# EAGLE design module (EAGLE 7.7.0)
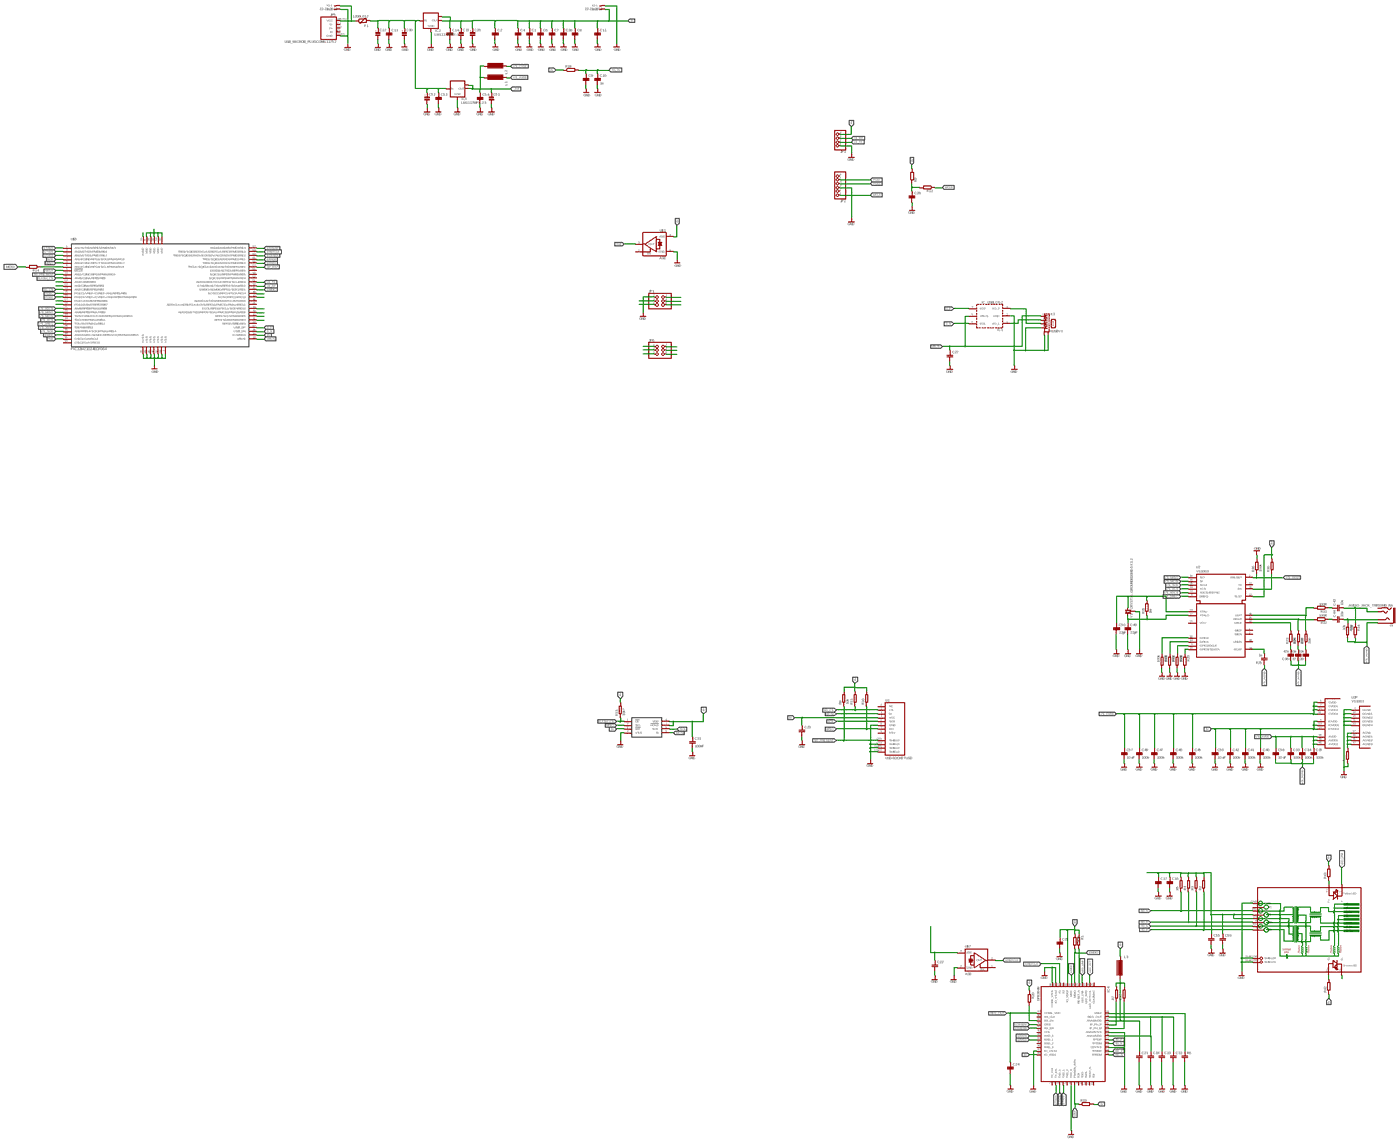
[diagram p0: schematic, sheet 1, overview]
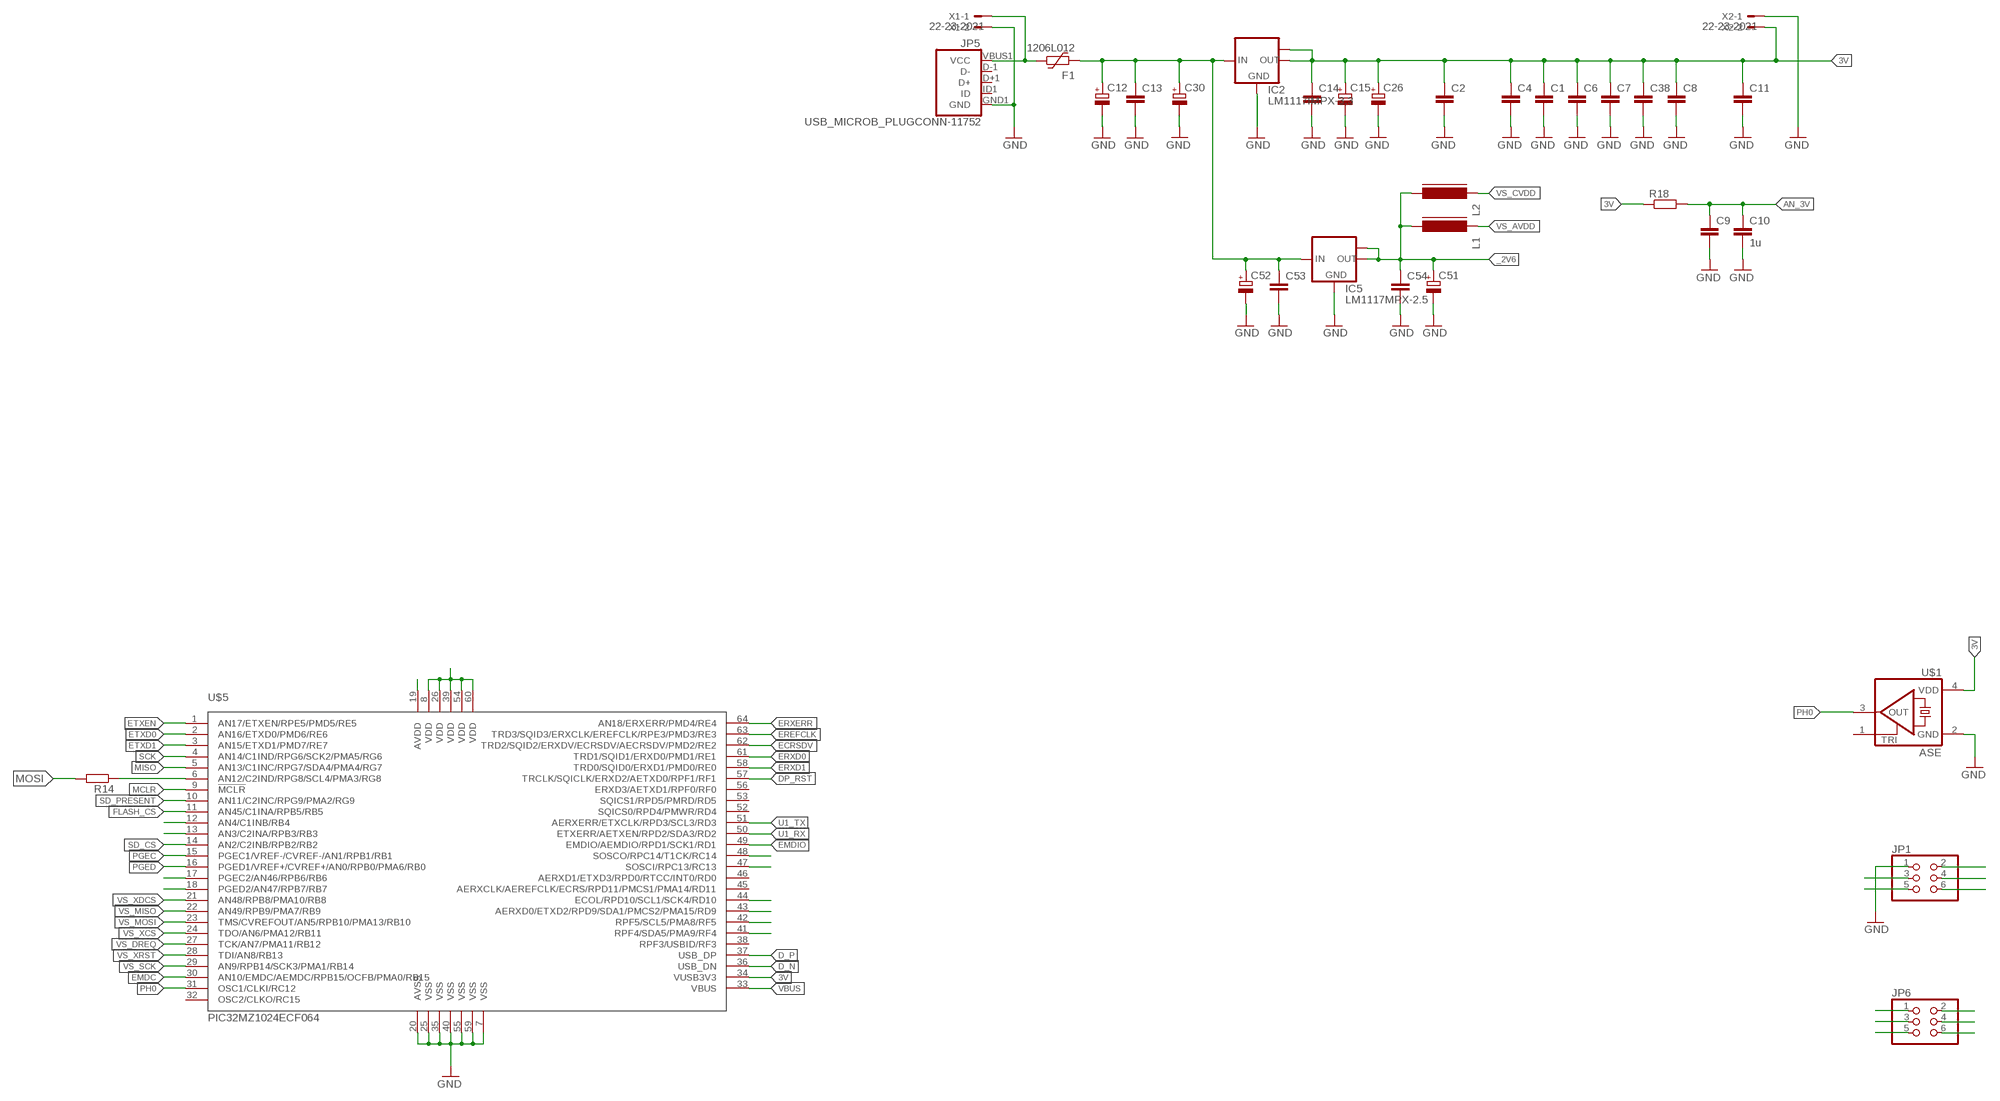
[diagram p1: schematic, sheet 1, part 1 of 4]
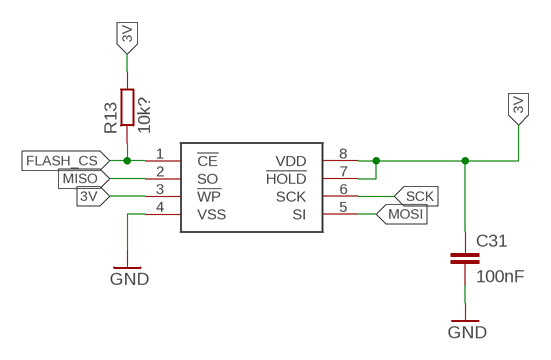
[diagram p2: schematic, sheet 1, part 2 of 4]
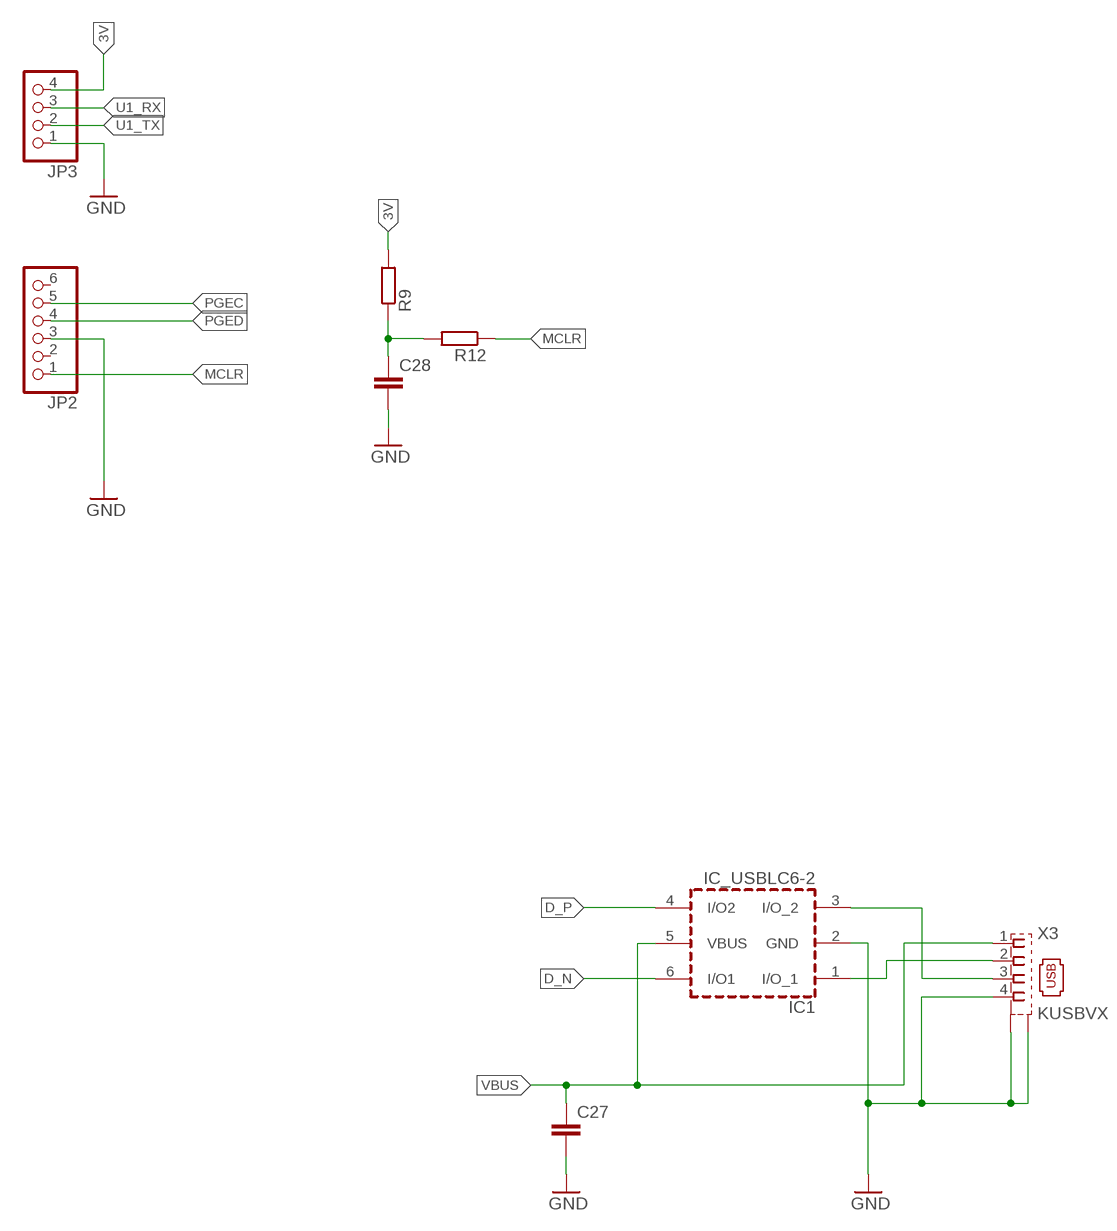
[diagram p3: schematic, sheet 1, part 3 of 4]
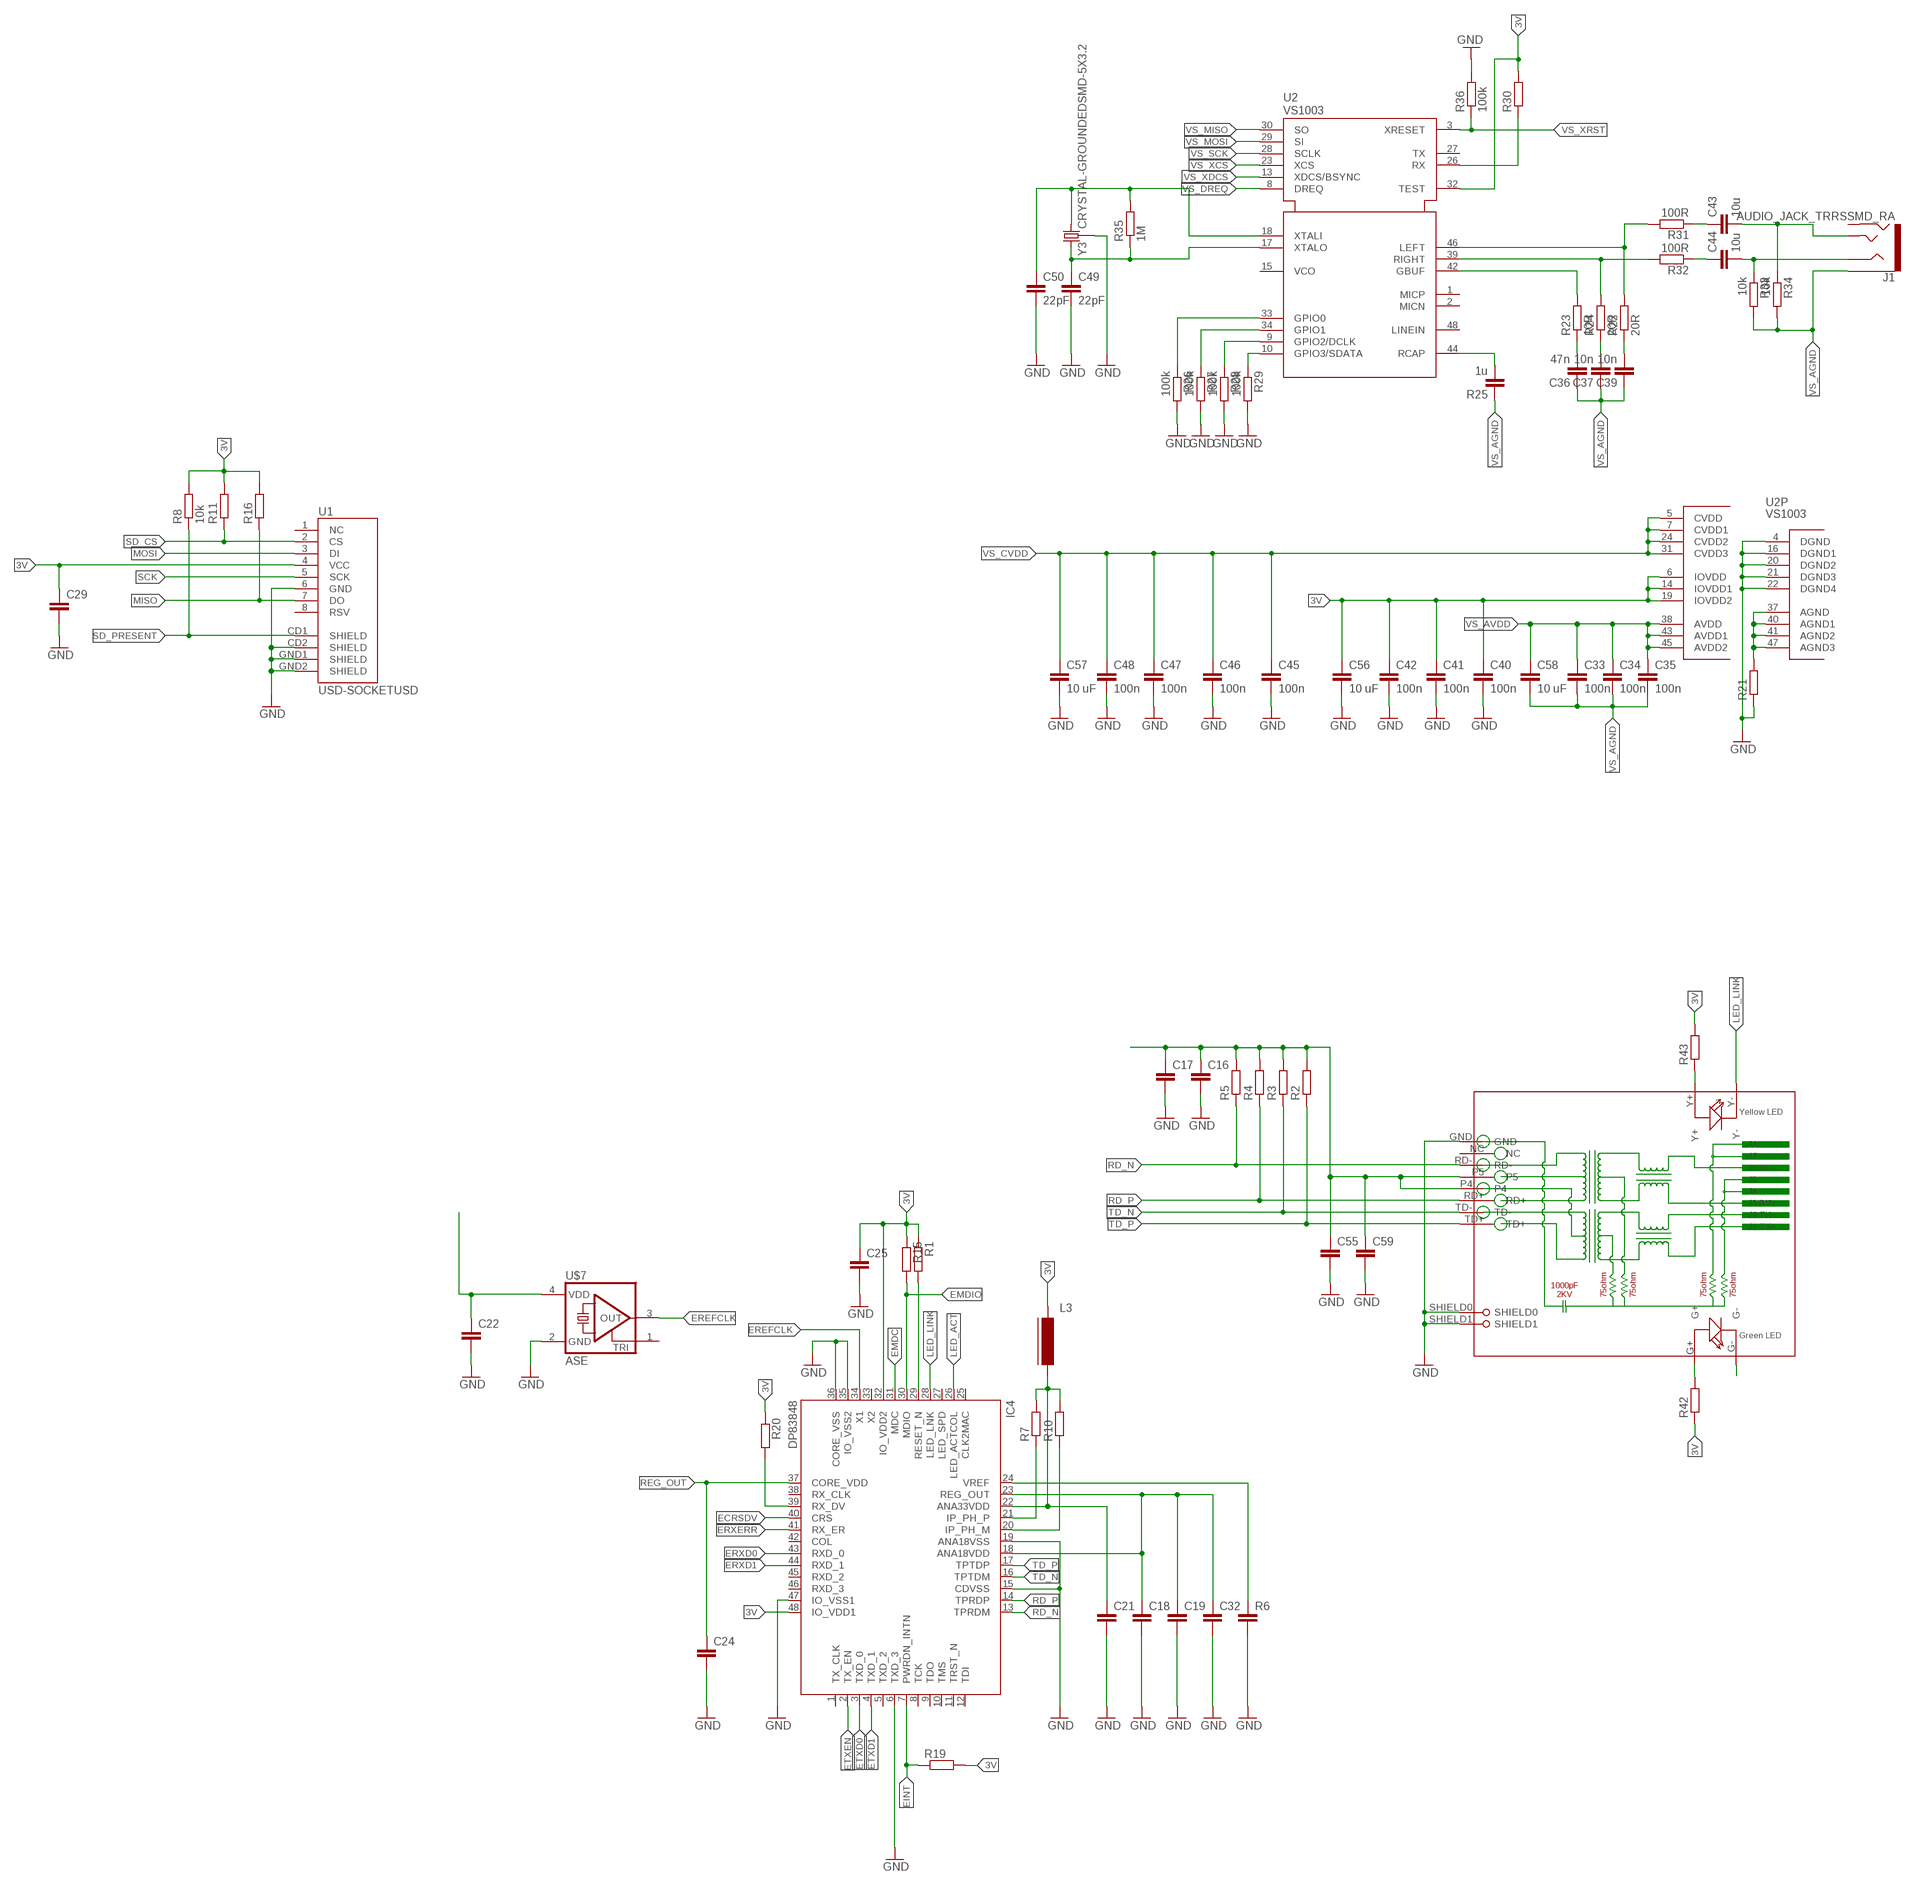
[diagram p4: schematic, sheet 1, part 4 of 4]

## Parts
C1  C-EUC0402  [C0402]
C2  C-EUC0402  [C0402]
C4  C-EUC0402  [C0402]
C6  C-EUC0402  [C0402]
C7  C-EUC0402  [C0402]
C8  C-EUC0402  [C0402]
C9  C-EUC0402  [C0402]
C10  1u  C-EUC0603  [C0603]
C11  C-EUC0402  [C0402]
C12  CPOL-EUSMCB  [SMC_B]
C13  C-EUC0603  [C0603]
C14  C-EUC0603  [C0603]
C15  CPOL-EUSMCB  [SMC_B]
C16  C-EUC0603  [C0603]
C17  C-EUC0603  [C0603]
C18  C-EUC0402  [C0402]
C19  C-EUC0402  [C0402]
C21  C-EUC0402  [C0402]
C22  C-EUC0402  [C0402]
C24  C-EUC0603  [C0603]
C25  C-EUC0603  [C0603]
C26  CPOL-EUSMCA  [SMC_A]
C27  C-EUC0603  [C0603]
C28  C-EUC0603  [C0603]
C29  C-EUC0603  [C0603]
C30  CPOL-EUSMCA  [SMC_A]
C31  100nF  C-EUC0603  [C0603]
C32  C-EUC0603  [C0603]
C33  100n  C-EUC0603  [C0603]
C34  100n  C-EUC0603  [C0603]
C35  100n  C-EUC0603  [C0603]
C36  47n  C-EUC0603  [C0603]
C37  10n  C-EUC0603  [C0603]
C38  C-EUC0402  [C0402]
C39  10n  C-EUC0603  [C0603]
C40  100n  C-EUC0402  [C0402]
C41  100n  C-EUC0402  [C0402]
C42  100n  C-EUC0402  [C0402]
C43  10u  C-EUC0603  [C0603]
C44  10u  C-EUC0603  [C0603]
C45  100n  C-EUC0402  [C0402]
C46  100n  C-EUC0603  [C0603]
C47  100n  C-EUC0603  [C0603]
C48  100n  C-EUC0603  [C0603]
C49  22pF  C-EUC0603  [C0603]
C50  22pF  C-EUC0603  [C0603]
C51  CPOL-EUSMCB  [SMC_B]
C52  CPOL-EUSMCB  [SMC_B]
C53  C-EUC0603  [C0603]
C54  C-EUC0603  [C0603]
C55  C-EUC0603  [C0603]
C56  10 uF  C-EUC0603  [C0603]
C57  10 uF  C-EUC0603  [C0603]
C58  10 uF  C-EUC0603  [C0603]
C59  C-EUC0603  [C0603]
F1  1206L012  [1206L]
IC1  IC_USBLC6-2  [SOT-23-6L]
IC2  LM1117IMPX-3.3  [SOT223]
IC4  DP83848  [LQFP48]
IC5  LM1117MPX-2.5  [SOT223]
J1  AUDIO_JACK_TRRSSMD_RA  [AUDIO_JACK_3.5MM_TRRS_SMD_RA]
JP1  PINHD-2X3  [2X03]
JP2  PINHD-1X6  [1X06]
JP3  PINHD-1X4  [1X04]
JP5  USB_MICROB_PLUGCONN-11752  [USB-B-MICRO-SMD_V03]
JP6  PINHD-2X3  [2X03]
L1  FERRITE-0805  [FB805]
L2  FERRITE-0805  [FB805]
L3  FERRITE-0805  [FB805]
R1  R-EU_R0402  [R0402]
R2  R-EU_R0603  [R0603]
R3  R-EU_R0603  [R0603]
R4  R-EU_R0603  [R0603]
R5  R-EU_R0603  [R0603]
R6  C-EUC0603  [C0603]
R7  R-EU_R0402  [R0402]
R8  10k  R-EU_R0603  [R0603]
R9  R-EU_R0603  [R0603]
R10  R-EU_R0402  [R0402]
R11  R-EU_R0603  [R0603]
R12  R-EU_R0402  [R0402]
R13  10k?  R-EU_R0603  [R0603]
R14  R-EU_R0603  [R0603]
R15  R-EU_R0603  [R0603]
R16  R-EU_R0603  [R0603]
R18  R-EU_R0805  [R0805]
R19  R-EU_R0402  [R0402]
R20  R-EU_R0603  [R0603]
R21  R-EU_R0603  [R0603]
R22  20R  R-EU_R0603  [R0603]
R23  10R  R-EU_R0603  [R0603]
R24  20R  R-EU_R0603  [R0603]
R25  1u  C-EUC0603  [C0603]
R26  100k  R-EU_R0402  [R0402]
R27  100k  R-EU_R0402  [R0402]
R28  100k  R-EU_R0402  [R0402]
R29  100k  R-EU_R0402  [R0402]
R30  R-EU_0204/7  [0204/7]
R31  100R  R-EU_R0603  [R0603]
R32  100R  R-EU_R0603  [R0603]
R33  10k  R-EU_R0603  [R0603]
R34  10k  R-EU_R0603  [R0603]
R35  1M  R-EU_R0603  [R0603]
R36  100k  R-EU_R0603  [R0603]
R42  R-EU_R0603  [R0603]
R43  R-EU_R0603  [R0603]
RJ1  HR911105A  [HR911105A]
U1  USD-SOCKETUSD  [USD-SOCKET-PP]
U2  VS1003  [LQFP48]
U$1  ASE  [ASE]
U$2  SST25VF016BSO8M  [SO-08M]
U$5  PIC32MZ1024ECF064  [TQFP64-10X10]
U$7  ASE  [ASE]
X1  22-23-2021  [22-23-2021]
X2  22-23-2021  [22-23-2021]
X3  KUSBVX  [KUSBVX]
Y3  CRYSTAL-GROUNDEDSMD-5X3.2  [CRYSTAL-SMD-5X3.2-4PAD]

## Nets
3V: C1.1 C2.1 C4.1 C6.1 C7.1 C8.1 C11.1 C14.1 C15.+ C22.1 C25.1 C26.+ C29.1 C31.1 C38.1 C40.1 C41.1 C42.1 C56.1 IC2.2(OUT) IC2.TAB(OUT1) IC4.32(IO_VDD2) IC4.48(IO_VDD1) JP1.2 JP3.4 L3.1 R1.1 R8.2 R9.2 R11.2 R13.2 R15.1 R16.2 R18.1 R19.2 R20.1 R30.2 R42.1 R43.2 U1.4(VCC) U2.6(IOVDD) U2.14(IOVDD1) U2.19(IOVDD2) U2.32(TEST) U$1.4(VDD) U$2.3(!WP) U$2.7(!HOLD) U$2.8(VDD) U$5.8(VDD) U$5.26(VDD) U$5.34(VUSB3V3) U$5.39(VDD) U$5.54(VDD) U$5.60(VDD) U$7.4(VDD) X2.2
_2V6: C51.+ C54.1 IC5.2(OUT) IC5.TAB(OUT1) L1.2 L2.2
A3V: C16.1 C17.1 C21.1 C55.1 C59.1 IC4.22(ANA33VDD) L3.2 R2.2 R3.2 R4.2 R5.2 R7.2 R10.2 RJ1.P4 RJ1.P5
AN_3V: C9.1 C10.1 R18.2 U$5.19(AVDD)
D2_N: IC1.1(I/O_1) X3.2
D2_P: IC1.3(I/O_2) X3.3
D_N: IC1.6(I/O1) U$5.36(USB_DN)
D_P: IC1.4(I/O2) U$5.37(USB_DP)
DP_RST: IC4.29(RESET_N) R1.2 U$5.57(TRCLK/SQICLK/ERXD2/AETXD0/RPF1/RF1)
ECRSDV: IC4.40(CRS) U$5.62(TRD2/SQID2/ERXDV/ECRSDV/AECRSDV/PMD2/RE2)
EINT: IC4.7(PWRDN_INTN) R19.1
EMDC: IC4.31(MDC) U$5.30(AN10/EMDC/AEMDC/RPB15/OCFB/PMA0/RB15)
EMDIO: IC4.30(MDIO) R15.2 U$5.49(EMDIO/AEMDIO/RPD1/SCK1/RD1)
EREFCLK: IC4.34(X1) U$5.63(TRD3/SQID3/ERXCLK/EREFCLK/RPE3/PMD3/RE3) U$7.3(OUT)
ERXD0: IC4.43(RXD_0) U$5.61(TRD1/SQID1/ERXD0/PMD1/RE1)
ERXD1: IC4.44(RXD_1) U$5.58(TRD0/SQID0/ERXD1/PMD0/RE0)
ERXERR: IC4.41(RX_ER) U$5.64(AN18/ERXERR/PMD4/RE4)
ETXD0: IC4.3(TXD_0) U$5.2(AN16/ETXD0/PMD6/RE6)
ETXD1: IC4.4(TXD_1) U$5.3(AN15/ETXD1/PMD7/RE7)
ETXEN: IC4.2(TX_EN) U$5.1(AN17/ETXEN/RPE5/PMD5/RE5)
FLASH_CS: R13.1 U$2.1(!CE) U$5.11(AN45/C1INA/RPB5/RB5)
GND: C1.2 C2.2 C4.2 C6.2 C7.2 C8.2 C9.2 C10.2 C11.2 C12.- C13.2 C14.2 C15.- C16.2 C17.2 C18.2 C19.2 C21.2 C22.2 C24.2 C25.2 C26.- C27.2 C28.2 C29.2 C30.- C31.2 C32.2 C38.2 C40.2 C41.2 C42.2 C45.2 C46.2 C47.2 C48.2 C49.2 C50.2 C51.- C52.- C53.2 C54.2 C55.2 C56.2 C57.2 C59.2 IC1.2(GND) IC2.1(GND) IC4.6(TXD_3) IC4.15(CDVSS) IC4.19(ANA18VSS) IC4.35(IO_VSS2) IC4.36(CORE_VSS) IC4.47(IO_VSS1) IC5.1(GND) JP1.1 JP2.3 JP3.1 JP5.GND1(GND) R6.2 R21.1 R26.2 R27.2 R28.2 R29.2 R36.2 RJ1.GND RJ1.SHIELD0 RJ1.SHIELD1 U1.6(GND) U1.CD2(SHIELD) U1.GND1(SHIELD) U1.GND2(SHIELD) U2.4(DGND) U2.16(DGND1) U2.20(DGND2) U2.21(DGND3) U2.22(DGND4) U$1.2(GND) U$2.4(VSS) U$5.7(VSS) U$5.20(AVSS) U$5.25(VSS) U$5.35(VSS) U$5.40(VSS) U$5.55(VSS) U$5.59(VSS) U$7.2(GND) X1.2 X2.1 X3.4 X3.M1(S1) X3.M2(S2) Y3.2 Y3.4
LED_ACT: IC4.26(LED_ACTCOL) RJ1.G-
LED_LINK: IC4.28(LED_LNK) RJ1.Y-
MCLR: JP2.1 R12.1 U$5.9(!MCLR)
MISO: R16.1 U1.7(DO) U$2.2(SO) U$5.5(AN13/C1INC/RPG7/SDA4/PMA4/RG7)
MOSI: R14.2 U1.3(DI) U$2.5(SI)
N$1: IC4.21(IP_PH_P) R7.1
N$2: C28.1 R9.1 R12.2
N$3: IC4.24(VREF) R6.1
N$4: R14.1 U$5.6(AN12/C2IND/RPG8/SCL4/PMA3/RG8)
N$6: IC4.20(IP_PH_M) R10.1
N$12: R42.2 RJ1.G+
N$17: F1.1 JP5.VBUS1(VCC) X1.1
N$18: C36.2 R23.1
N$19: R43.1 RJ1.Y+
PGEC: JP2.5 U$5.15(PGEC1/VREF-/CVREF-/AN1/RPB1/RB1)
PGED: JP2.4 U$5.16(PGED1/VREF+/CVREF+/AN0/RPB0/PMA6/RB0)
PH0: U$1.3(OUT) U$5.31(OSC1/CLKI/RC12)
RB3: JP1.5 U$5.13(AN3/C2INA/RPB3/RB3)
RB4: JP1.3 U$5.12(AN4/C1INB/RB4)
RB6: JP1.6 U$5.17(PGEC2/AN46/RPB6/RB6)
RB7: JP1.4 U$5.18(PGED2/AN47/RPB7/RB7)
RC13: JP6.5 U$5.47(SOSCI/RPC13/RC13)
RC14: JP6.6 U$5.48(SOSCO/RPC14/T1CK/RC14)
RD_N: IC4.13(TPRDM) R5.1 RJ1.RD-
RD_P: IC4.14(TPRDP) R4.1 RJ1.RD+
REG_OUT: C18.1 C19.1 C24.1 C32.1 IC4.18(ANA18VDD) IC4.23(REG_OUT) IC4.37(CORE_VDD)
RX_DV: IC4.39(RX_DV) R20.2
SCK: U1.5(SCK) U$2.6(SCK) U$5.4(AN14/C1IND/RPG6/SCK2/PMA5/RG6)
SCL1: JP6.4 U$5.44(ECOL/RPD10/SCL1/SCK4/RD10)
SCL5: JP6.2 U$5.42(RPF5/SCL5/PMA8/RF5)
SD_CS: R11.1 U1.2(CS) U$5.14(AN2/C2INB/RPB2/RB2)
SD_PRESENT: R8.1 U1.CD1(SHIELD) U$5.10(AN11/C2INC/RPG9/PMA2/RG9)
SDA1: JP6.3 U$5.43(AERXD0/ETXD2/RPD9/SDA1/PMCS2/PMA15/RD9)
SDA5: JP6.1 U$5.41(RPF4/SDA5/PMA9/RF4)
TD_N: IC4.16(TPTDM) R3.1 RJ1.TD-
TD_P: IC4.17(TPTDP) R2.1 RJ1.TD+
U1_RX: JP3.3 U$5.50(ETXERR/AETXEN/RPD2/SDA3/RD2)
U1_TX: JP3.2 U$5.51(AERXERR/ETXCLK/RPD3/SCL3/RD3)
VBUS: C12.+ C13.1 C27.1 C30.+ C52.+ C53.1 F1.2 IC1.5(VBUS) IC2.3(IN) IC5.3(IN) U$5.33(VBUS) X3.1
VS_AGND: C33.2 C34.2 C35.2 C36.1 C37.1 C39.1 C58.2 J1.EARTH R21.2 R25.1 R33.2 R34.2 U2.37(AGND) U2.40(AGND1) U2.41(AGND2) U2.47(AGND3)
VS_AVDD: C33.1 C34.1 C35.1 C58.1 L1.1 U2.38(AVDD) U2.43(AVDD1) U2.45(AVDD2)
VS_CVDD: C45.1 C46.1 C47.1 C48.1 C57.1 L2.1 U2.5(CVDD) U2.7(CVDD1) U2.24(CVDD2) U2.31(CVDD3)
VS_DREQ: U2.8(DREQ) U$5.27(TCK/AN7/PMA11/RB12)
VS_MISO: U2.30(SO) U$5.22(AN49/RPB9/PMA7/RB9)
VS_MOSI: U2.29(SI) U$5.23(TMS/CVREFOUT/AN5/RPB10/PMA13/RB10)
VS_N$9: C50.1 R35.2 U2.18(XTALI) Y3.1
VS_N$13: C49.1 R35.1 U2.17(XTALO) Y3.3
VS_N$14: R22.2 R31.2 U2.46(LEFT)
VS_N$15: R23.2 U2.42(GBUF)
VS_N$16: R24.2 R32.2 U2.39(RIGHT)
VS_N$17: R25.2 U2.44(RCAP)
VS_N$24: C37.2 R24.1
VS_N$25: C39.2 R22.1
VS_N$26: R29.1 U2.10(GPIO3/SDATA)
VS_N$27: R28.1 U2.9(GPIO2/DCLK)
VS_N$28: R27.1 U2.34(GPIO1)
VS_N$30: R26.1 U2.33(GPIO0)
VS_N$34: R30.1 U2.26(RX)
VS_N$35: C43.1 R31.1
VS_N$36: C44.1 R32.1
VS_N$37: C44.2 J1.RING1 R33.1
VS_N$38: C43.2 J1.TIP R34.1
VS_SCK: U2.28(SCLK) U$5.29(AN9/RPB14/SCK3/PMA1/RB14)
VS_XCS: U2.23(XCS) U$5.24(TDO/AN6/PMA12/RB11)
VS_XDCS: U2.13(XDCS/BSYNC) U$5.21(AN48/RPB8/PMA10/RB8)
VS_XRST: R36.1 U2.3(XRESET) U$5.28(TDI/AN8/RB13)
Unconnected: IC4.1(TX_CLK) IC4.5(TXD_2) IC4.8(TCK) IC4.9(TDO) IC4.10(TMS) IC4.11(TRST_N) IC4.12(TDI) IC4.25(CLK2MAC) IC4.27(LED_SPD) IC4.33(X2) IC4.38(RX_CLK) IC4.42(COL) IC4.45(RXD_2) IC4.46(RXD_3) J1.RING2 JP2.2 JP2.6 JP5.D+1(D+) JP5.D-1(D-) JP5.ID1(ID) RJ1.NC U1.1(NC) U1.8(RSV) U2.1(MICP) U2.2(MICN) U2.15(VCO) U2.27(TX) U2.48(LINEIN) U$1.1(TRI) U$5.32(OSC2/CLKO/RC15) U$5.38(RPF3/USBID/RF3) U$5.45(AERXCLK/AEREFCLK/ECRS/RPD11/PMCS1/PMA14/RD11) U$5.46(AERXD1/ETXD3/RPD0/RTCC/INT0/RD0) U$5.52(SQICS0/RPD4/PMWR/RD4) U$5.53(SQICS1/RPD5/PMRD/RD5) U$5.56(ERXD3/AETXD1/RPF0/RF0) U$7.1(TRI)

## Library data of the parts
C1 C2 C4 C6-C11 C13 C14 C16-C19 C21 C22 C24 C25 C27-C29 C31-C50 C53-C59 R6 R25 = rcl:C-EU: CAPACITOR, European symbol
C12 C15 C26 C30 C51 C52 = rcl:CPOL-EU: POLARIZED CAPACITOR, European symbol
F1 = polyfuse-smd_10:?: Polyfuse Resettable PTC Source: http://www.littelfuse.com/products/resettable-ptcs.aspx; MF: Littelfuse; MPN: 1206L012; OC_FARNELL: 1596988; OC_NEWARK: 05M2298
IC1 = dp_devices:IC_USBLC6-2
IC2 = lm1117:LM1117IMPX-*
IC4 = national-semiconductor:DP83848: PHYTER® - Extended Temperature Single Port 10/100 Mb/s Ethernet Physical Layer Transceiver Auto generated by make-symbol-device-package-bsdl.ulp Rev. 34 Source: dp83848yb.bsdl http://www.national.com/ds/DP/DP83848VYB.pdf; MPN: DP83848VYB; OC_FARNELL: 1286817; OC_NEWARK: 11N4484
IC5 = lm1117:LM1117MPX-*
J1 = SparkFun-Connectors:AUDIO_JACK_TRRS: Audio Jack - 3.5mm TRRS (SMD) This is a 3.5mm TRRS SMD audio jack. TRRS connectors are the audio-style connectors that you see on some phones, MP3 players and development boards. TRRS stands for “tip, ring, ring, sleeve,” which reflects that this has three conductors and a ground. SparkFun Products: Audio Jack <https://www.sparkfun.com/products/12639> mbed Starter Kit <https://www.sparkfun.com/products/12968> SparkFun TRRS 3.5mm Jack Breakout <https://www.sparkfun.com/products/11570>; PROD_ID: CONN-10676; SF_ID: PRT-12639
JP1 JP6 = pinhead:PINHD-2X3: PIN HEADER
JP2 = pinhead:PINHD-1X6: PIN HEADER
JP3 = pinhead:PINHD-1X4: PIN HEADER
JP5 = SparkFun-Connectors:USB_MICROB_PLUG: USB Micro-B connectors Some male, some female. Watch your step!; PROD_ID: CONN-11752
L1-L3 = dp_devices:FERRITE: Ferrite bead in various packages
R1-R5 R7-R16 R18-R24 R26-R36 R42 R43 = rcl:R-EU_: RESISTOR, European symbol
RJ1 = hanrun:HR911105A
U1 = SparkFun-Connectors:USD-SOCKET: microSD Socket Push-push type uSD socket. Schematic element and footprint production proven. Spark Fun Electronics SKU : PRT-00127. tDoc lines correctly indicate media card edge positions when inserting (unlocked, locked, depressed).
U2 = vlsi-web:VS1003: MP3 / WMA / MIDI Audio Codec Circuit
U$1 U$7 = crystal:ASE: 3.3Vdc CMOS SMD CRYSTAL CLOCK OSCILLATOR SOurce: www.abracon.com; OC_FARNELL: unknown; OC_NEWARK: unknown
U$2 = mw:SST25VF016B
U$5 = mw:PIC32MZ1024ECF064
X1 X2 = con-molex:22-23-2021: .100" (2.54mm) Center Header - 2 Pin; MF: MOLEX; MPN: 22-23-2021; OC_FARNELL: 1462926; OC_NEWARK: 25C3832
X3 = con-kycon:KUSBVX: Vertical,Top Entry Universal Serial Bus Connector KUSBVX Series Source: KYCON Sibalco USB vertical socket KUSBV.pdf
Y3 = SparkFun-Clocks:CRYSTAL-GROUNDED: Crystals w/ Ground Pin (Generic) These are passive quartz crystals, which can be used as a clock source for a microcontroller. Crystal's are usually two-terminal devices. A third terminal may be optionally connected to ground, as recommended by the manufaturer.

## Board
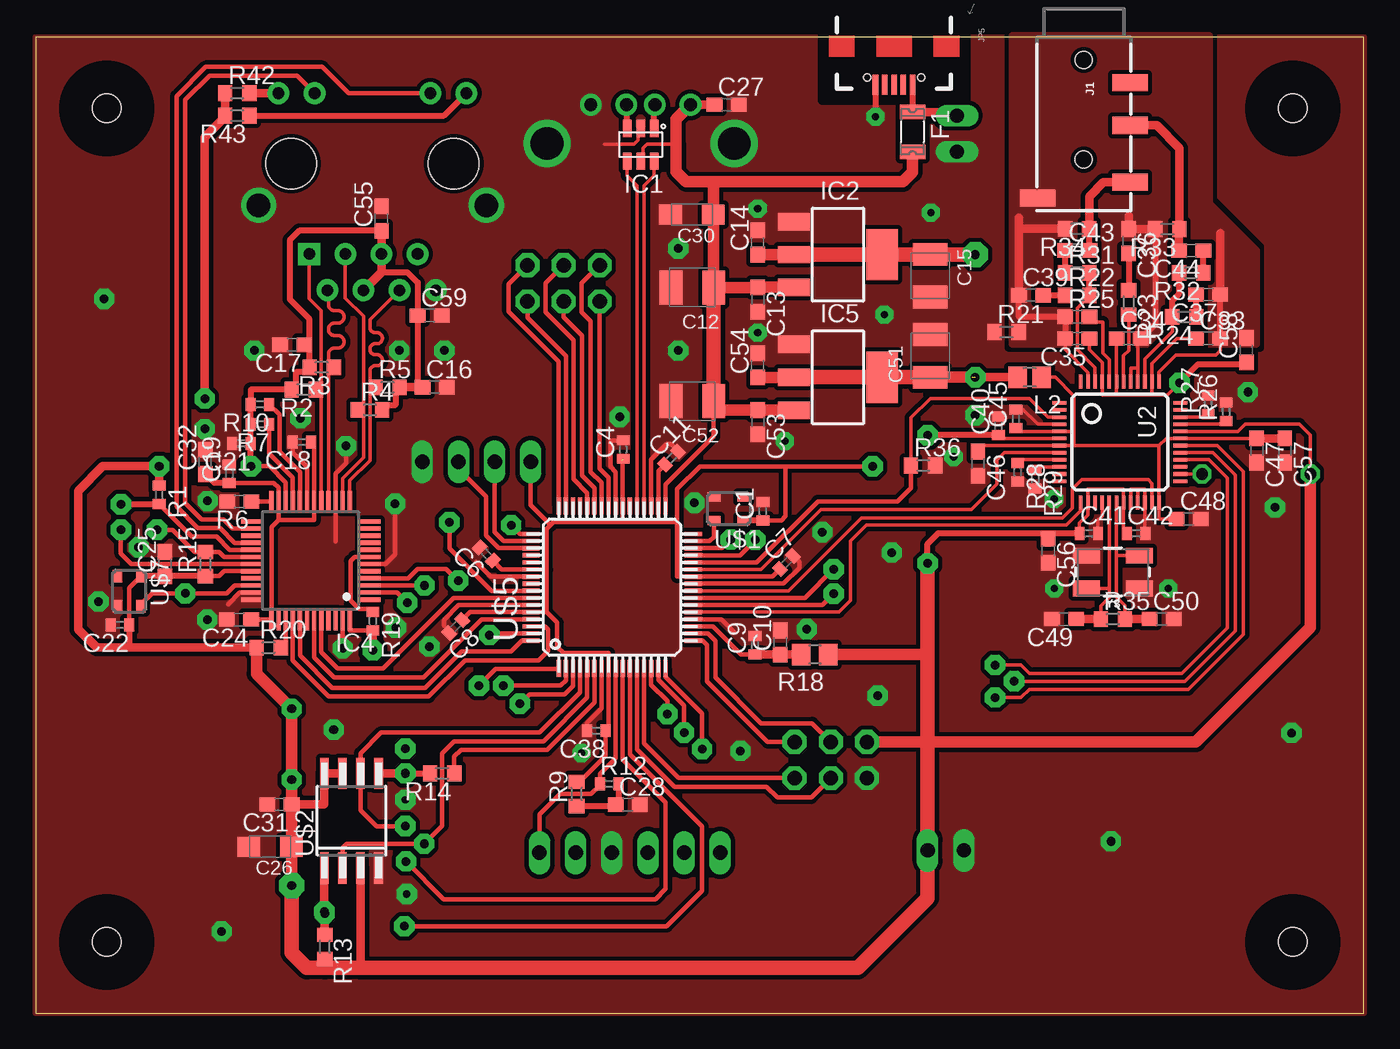
[diagram p5: board, top side]
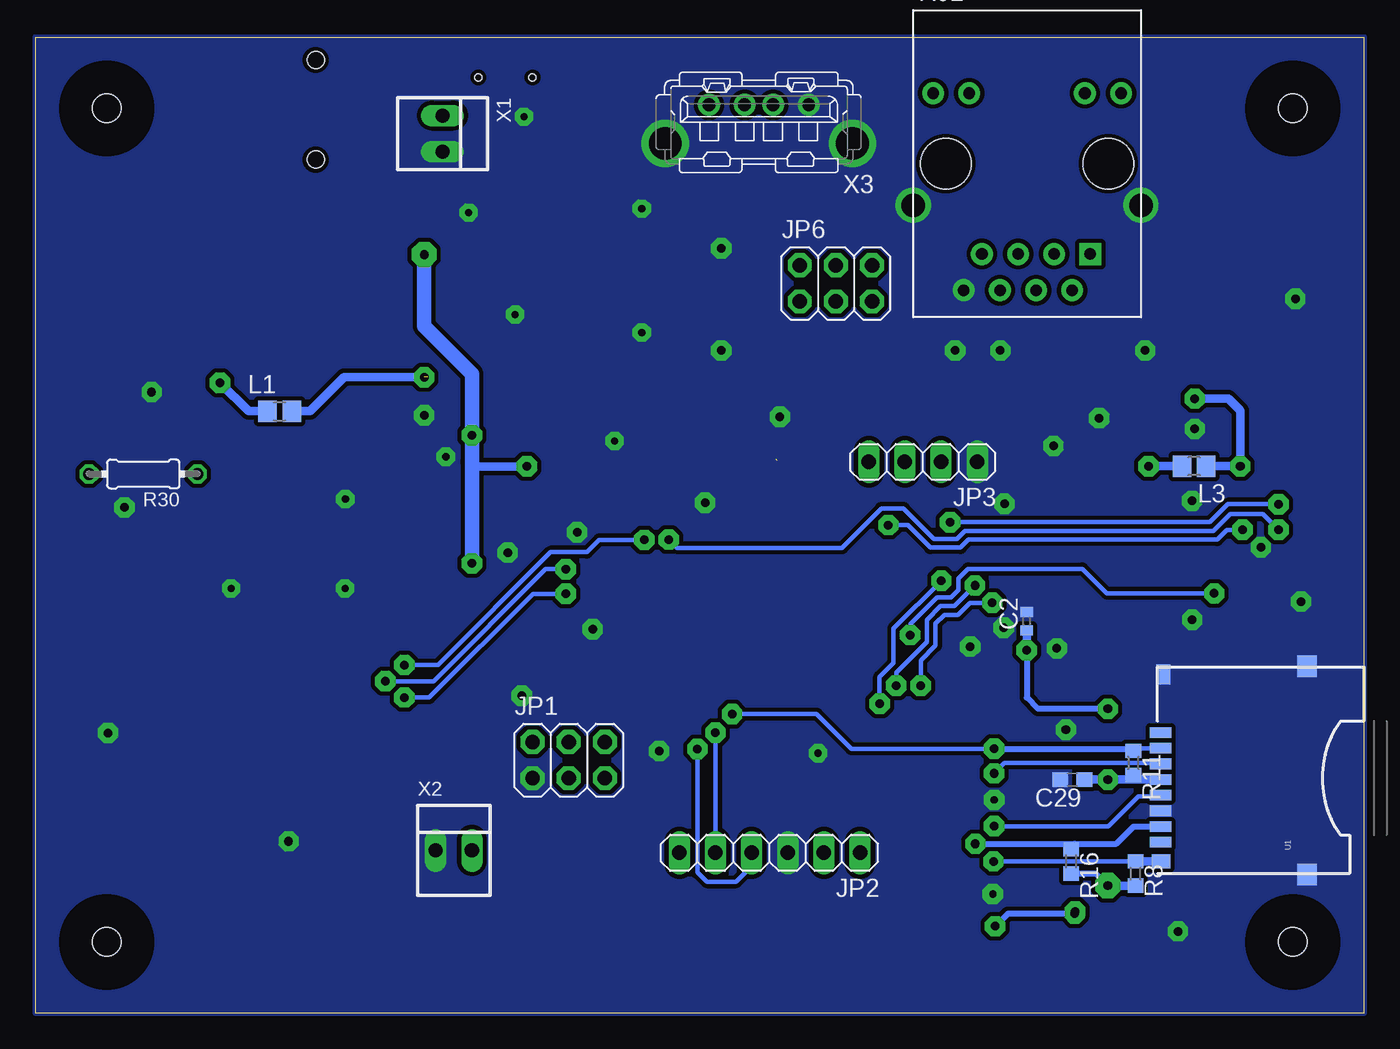
[diagram p6: board, bottom side, seen from below]

Size 93.34 x 68.58 mm. Coordinates in mm from the lower left corner, seen from the top.
Outline: 0,0 93.34,0 93.34,68.58 0,68.58 0,0
Copper layers (1*16): Top 0.035mm / dielectric 1.5mm / Bottom 0.035mm
Design rules "default *": minimum track width 10mil, minimum drill 24mil, track to track 8mil, track to pad 8mil, pad to pad 8mil, via to via 8mil, smd to smd 8mil, copper to edge 0mil, drill to drill 8mil, minimum pad ring 10mil, minimum via ring 8mil, stop-mask expansion 4mil, vias tented up to drill 0mil, thermal gap 10mil
Holes 2 mm at 5,5 88.34,5 88.34,63.58 5,63.58
tRestrict: area 41.3,60 to 43.8,61.9; area 60.7,61 to 62.5,62.9; area 55.2,64.1 to 65.4,68.6; area 2,2 to 8,8; area 85.3,2 to 91.4,8; area 85.3,60.5 to 91.4,66.6; area 2,60.5 to 8,66.6; area 73.3,43.9 to 79,44.9; area 71.4,37.2 to 72.5,43; area 79.9,37.2 to 81,43; area 73.3,35.4 to 79.1,37.3
bRestrict: area 2,2 to 8,8; area 85.3,2 to 91.4,8; area 85.3,60.5 to 91.4,66.6; area 2,60.5 to 8,66.6

### Footprints (pad centres in the part's own frame; a part is rotated, then mirrored left to right if it is on the bottom)
C0402 = smd 0.7 x 0.9: 1 -0.65,0; 2 0.65,0
C0603 = smd 1.1 x 1: 1 -0.85,0; 2 0.85,0
SMC_B = smd 1.6 x 2.4: + -1.5,0; - 1.5,0
SMC_A = smd 1.6 x 1.4: + -1.5,0; - 1.5,0
1206L = smd 1 x 1.8: 1 -1.4,0; 2 1.4,0
SOT-23-6L = smd 0.6 x 1.2: 1 -0.95,-2.3; 2 0,-2.3; 3 0.95,-2.3; 4 0.95,0; 5 0,0; 6 -0.95,0
SOT223 = smd 1.219 x 2.235: 1 -2.311,-3.099; 2 0,-3.099; 3 2.311,-3.099 | smd 3.6 x 2.2: TAB 0,3.099
LQFP48 = smd 1.5 x 0.3: 1 -4.15,2.75; 2 -4.15,2.25; 3 -4.15,1.75; 4 -4.15,1.25; 5 -4.15,0.75; 6 -4.15,0.25; 7 -4.15,-0.25; 8 -4.15,-0.75; 9 -4.15,-1.25; 10 -4.15,-1.75; 11 -4.15,-2.25; 12 -4.15,-2.75; 25 4.15,-2.75; 26 4.15,-2.25; 27 4.15,-1.75; 28 4.15,-1.25; 29 4.15,-0.75; 30 4.15,-0.25; 31 4.15,0.25; 32 4.15,0.75; 33 4.15,1.25; 34 4.15,1.75; 35 4.15,2.25; 36 4.15,2.75 | smd 0.3 x 1.5: 13 -2.75,-4.15; 14 -2.25,-4.15; 15 -1.75,-4.15; 16 -1.25,-4.15; 17 -0.75,-4.15; 18 -0.25,-4.15; 19 0.25,-4.15; 20 0.75,-4.15; 21 1.25,-4.15; 22 1.75,-4.15; 23 2.25,-4.15; 24 2.75,-4.15; 37 2.75,4.15; 38 2.25,4.15; 39 1.75,4.15; 40 1.25,4.15; 41 0.75,4.15; 42 0.25,4.15; 43 -0.25,4.15; 44 -0.75,4.15; 45 -1.25,4.15; 46 -1.75,4.15; 47 -2.25,4.15; 48 -2.75,4.15
AUDIO_JACK_3.5MM_TRRS_SMD_RA = smd 1.2 x 2.5: EARTH 11.3,-3.25; RING1 6.2,3.25; RING2 3.2,3.25; TIP 10.2,3.25 | hole 1.2: 1.6,0; 8.6,0
2X03 = drill 1.016 pad 1.676 octagon: 1 -2.54,-1.27; 2 -2.54,1.27; 3 0,-1.27; 4 0,1.27; 5 2.54,-1.27; 6 2.54,1.27
1X06 = drill 1.016 long: 1 -6.35,0; 2 -3.81,0; 3 -1.27,0; 4 1.27,0; 5 3.81,0; 6 6.35,0
1X04 = drill 1.016 long: 1 -3.81,0; 2 -1.27,0; 3 1.27,0; 4 3.81,0
USB-B-MICRO-SMD_V03 = smd 1.4 x 0.4: D+1 2.7,0; D-1 2.7,0.65; GND1 2.7,-1.3; ID1 2.7,-0.65; VBUS1 2.7,1.3 | hole 0.5: 2.2,1.9; 2.2,-1.9
FB805 = smd 1.3 x 1.5: 1 -0.85,0; 2 0.85,0
R0402 = smd 0.7 x 0.9: 1 -0.65,0; 2 0.65,0
R0603 = smd 1 x 1.1: 1 -0.85,0; 2 0.85,0
R0805 = smd 1.3 x 1.5: 1 -0.95,0; 2 0.95,0
0204/7 = drill 0.813 octagon: 1 -3.81,0; 2 3.81,0
HR911105A = drill 0.813 pad 1.524: G+ 4.953,-6.604; G- 4.953,-4.064; GND -8.89,4.445; NC -6.35,3.175; P4 -8.89,-0.635; P5 -6.35,0.635; RD+ -6.35,-1.905; RD- -8.89,1.905; TD- -8.89,-3.175; Y+ 4.953,6.604; Y- 4.953,4.064 | drill 1.651 pad 2.159: SHIELD0 -2.921,8.001; SHIELD1 -2.921,-8.001 | drill 0.813 pad 1.524 square: TD+ -6.35,-4.445 | hole 3.556: 0,-5.715; 0,5.715
USD-SOCKET-PP = smd 0.75 x 1.5: 1 3.2,14.3; 2 2.1,14.3; 3 1,14.3; 4 -0.1,14.3; 5 -1.2,14.3; 6 -2.3,14.3; 7 -3.4,14.3; 8 -4.5,14.3 | smd 1 x 1.3: CD1 -5.85,14.25 | smd 1.4 x 1: CD2 7.275,14.1 | smd 1.5 x 1.35: GND1 -6.775,4; GND2 7.875,4
LQFP48' = smd 0.25 x 1: 1 -2.75,-4.25; 2 -2.25,-4.25; 3 -1.75,-4.25; 4 -1.25,-4.25; 5 -0.75,-4.25; 6 -0.25,-4.25; 7 0.25,-4.25; 8 0.75,-4.25; 9 1.25,-4.25; 10 1.75,-4.25; 11 2.25,-4.25; 12 2.75,-4.25; 25 2.75,4.25; 26 2.25,4.25; 27 1.75,4.25; 28 1.25,4.25; 29 0.75,4.25; 30 0.25,4.25; 31 -0.25,4.25; 32 -0.75,4.25; 33 -1.25,4.25; 34 -1.75,4.25; 35 -2.25,4.25; 36 -2.75,4.25 | smd 1 x 0.25: 13 4.25,-2.75; 14 4.25,-2.25; 15 4.25,-1.75; 16 4.25,-1.25; 17 4.25,-0.75; 18 4.25,-0.25; 19 4.25,0.25; 20 4.25,0.75; 21 4.25,1.25; 22 4.25,1.75; 23 4.25,2.25; 24 4.25,2.75; 37 -4.25,2.75; 38 -4.25,2.25; 39 -4.25,1.75; 40 -4.25,1.25; 41 -4.25,0.75; 42 -4.25,0.25; 43 -4.25,-0.25; 44 -4.25,-0.75; 45 -4.25,-1.25; 46 -4.25,-1.75; 47 -4.25,-2.25; 48 -4.25,-2.75
ASE = smd 0.9 x 0.65: 1 -1.05,-0.825; 2 1.05,-0.825; 3 1.05,0.825; 4 -1.05,0.825
SO-08M = smd 0.6 x 2.2: 1 -1.905,-3.33; 2 -0.635,-3.33; 3 0.635,-3.33; 4 1.905,-3.33; 5 1.905,3.33; 6 0.635,3.33; 7 -0.635,3.33; 8 -1.905,3.33
TQFP64-10X10 = smd 1.2 x 0.3: 1 -5.7,3.75; 2 -5.7,3.25; 3 -5.7,2.75; 4 -5.7,2.25; 5 -5.7,1.75; 6 -5.7,1.25; 7 -5.7,0.75; 8 -5.7,0.25; 9 -5.7,-0.25; 10 -5.7,-0.75; 11 -5.7,-1.25; 12 -5.7,-1.75; 13 -5.7,-2.25; 14 -5.7,-2.75; 15 -5.7,-3.25; 16 -5.7,-3.75; 33 5.7,-3.75; 34 5.7,-3.25; 35 5.7,-2.75; 36 5.7,-2.25; 37 5.7,-1.75; 38 5.7,-1.25; 39 5.7,-0.75; 40 5.7,-0.25; 41 5.7,0.25; 42 5.7,0.75; 43 5.7,1.25; 44 5.7,1.75; 45 5.7,2.25; 46 5.7,2.75; 47 5.7,3.25; 48 5.7,3.75 | smd 0.3 x 1.2: 17 -3.75,-5.7; 18 -3.25,-5.7; 19 -2.75,-5.7; 20 -2.25,-5.7; 21 -1.75,-5.7; 22 -1.25,-5.7; 23 -0.75,-5.7; 24 -0.25,-5.7; 25 0.25,-5.7; 26 0.75,-5.7; 27 1.25,-5.7; 28 1.75,-5.7; 29 2.25,-5.7; 30 2.75,-5.7; 31 3.25,-5.7; 32 3.75,-5.7; 49 3.75,5.7; 50 3.25,5.7; 51 2.75,5.7; 52 2.25,5.7; 53 1.75,5.7; 54 1.25,5.7; 55 0.75,5.7; 56 0.25,5.7; 57 -0.25,5.7; 58 -0.75,5.7; 59 -1.25,5.7; 60 -1.75,5.7; 61 -2.25,5.7; 62 -2.75,5.7; 63 -3.25,5.7; 64 -3.75,5.7
22-23-2021 = drill 1 long: 1 -1.27,0; 2 1.27,0
KUSBVX = drill 0.9 pad 1.524: 1 3.5,0; 2 1,0; 3 -1,0; 4 -3.5,0 | drill 2.3 pad 2.8: M1 -6.57,2.71; M2 6.57,2.71
CRYSTAL-SMD-5X3.2-4PAD = smd 1.9 x 1.1: 1 -1.85,-1.15; 2 1.85,-1.15; 3 1.85,1.15; 4 -1.85,1.15

### Placement (x,y rotation side)
C1  51.1,35.27 90 top
C2  23.7,27.54 90 bottom
C4  41.3,39.6 90 top
C6  31.67,32.25 135 top
C7  52.77,31.67 45 top
C8  29.53,27.18 225 top
C9  50.55,25.84 90 top
C10  52.33,26.04 90 top
C11  44.69,39.01 45 top
C12  46.15,50.99 180 top
C13  50.75,50.14 270 top
C14  50.75,54.15 90 top
C15  62.87,51.82 270 top
C16  28.05,43.98 0 top
C17  18.03,46.96 180 top
C18  18.73,40.13 180 top
C19  13.61,37.91 90 top
C21  14.47,40.03 180 top
C22  5.92,27.28 180 top
C24  14.3,27.65 180 top
C25  9.09,31.55 90 top
C26  16.48,11.68 180 top
C27  48.56,63.83 0 top
C28  41.61,14.64 0 top
C29  20.5,16.41 180 bottom
C30  46.13,56.11 180 top
C31  17.14,14.67 180 top
C32  11.94,38.73 90 top
C33  82.4,47.41 0 top
C34  76.81,47.41 0 top
C35  73.2,47.41 180 top
C36  76.81,54.24 270 top
C37  82.4,50.5 180 top
C38  39.41,19.85 180 top
C39  69.95,50.44 0 top
C40  67.66,41.26 90 top
C41  74.02,33.71 0 top
C42  77.32,33.71 0 top
C43  73.2,53.59 0 top
C44  81.2,53.58 180 top
C45  68.88,41.76 90 top
C46  66.22,38.61 270 top
C47  85.8,39.53 270 top
C48  81.03,34.72 0 top
C49  72.27,27.69 180 top
C50  79.13,27.69 0 top
C51  62.87,46.18 90 top
C52  46.15,43 180 top
C53  50.75,41.53 270 top
C54  50.75,45.52 90 top
C55  24.31,55.83 90 top
C56  71.15,32.49 270 top
C57  87.78,39.53 270 top
C58  85.09,46.58 90 top
C59  27.7,49.02 0 top
F1  61.62,61.93 270 top
IC1  42.52,59.87 180 top
IC2  56.39,53.3 270 top
IC4  19.33,31.8 180 top
IC5  56.39,44.68 270 top
J1  73.66,68.58 270 top
JP1  55.88,17.78 0 bottom
JP2  41.76,11.26 180 bottom
JP3  30.99,38.73 180 bottom
JP5  60.33,67.94 270 top
JP6  37.11,51.28 0 bottom
L1  76.2,42.29 0 bottom
L2  69.85,44.68 180 top
L3  11.94,38.43 180 bottom
R1  8.69,36.42 270 top
R2  18.85,43.81 180 top
R3  20.11,45.39 180 top
R4  23.5,42.39 0 top
R5  24.74,43.98 0 top
R6  14.33,35.95 180 top
R7  15.77,41.38 180 top
R8  16.05,9.8 270 bottom
R9  38.01,15.39 90 top
R10  15.77,42.77 180 top
R11  16.21,17.58 270 bottom
R12  40.31,16.1 0 top
R13  20.32,4.65 270 top
R14  28.57,16.84 180 top
R15  11.94,31.55 90 top
R16  20.57,10.65 270 bottom
R18  54.76,25.19 180 top
R19  23.7,27.55 270 top
R20  16.38,25.68 0 top
R21  68.22,47.85 0 top
R22  73.2,50.44 0 top
R23  76.81,49.94 270 top
R24  80.72,48.92 180 top
R25  73.2,48.92 0 top
R26  83.66,42.26 90 top
R27  82.4,42.76 90 top
R28  69.01,38.01 270 top
R29  70.23,37.51 270 top
R30  85.78,37.88 180 bottom
R31  73.2,52.02 0 top
R32  81.2,52.02 180 top
R33  79.53,55.09 180 top
R34  73.19,55.12 180 top
R35  75.7,27.69 0 top
R36  62.37,38.48 0 top
R42  14.17,64.64 0 top
R43  14.17,63.07 180 top
RJ1  23.67,59.69 90 bottom
U1  0,16.51 90 bottom
U2  VS1003  [LQFP48']  76.2,40.13 270 top
U$1  48.72,35.44 180 top
U$2  22.2,13.51 0 top
U$5  40.51,29.92 90 top
U$7  6.58,29.64 270 top
X1  64.74,61.8 270 bottom
X2  63.96,11.43 0 bottom
X3  42.52,63.83 180 bottom
Y3  75.7,30.99 180 top

### Tracks (layer width: path | path; a pad name or v marks a point on that pad's centre or on a via)
3V  (via drill 0.6 pad 1.42, 0.6 pad 1.78)  (1 unrouted)
  Top 0.251: U2.6 67.89,40.38 C40.1 | C42.1 76.45,33.93 U2.19 76.45,36.83 73.95,36.83 U2.14 73.95,35.01 73.37,34.43 C41.1 | R30.2 89.59,40.62 88.8,41.4 85.01,41.4 84.49,40.88 U2.32
  Top 0.305: IC4.32 13.24,31.05 12.89,30.7 R15.1 | 8.77,30.7 8.76,30.7 | U$7.4 6.58,29.87 6.58,27.36 6.57,27.34 C22.1 | R19.2 22.08,26.9 IC4.48 | C8.1 30.52,28.17 U$5.60 35.92,28.17 | 35.92,31.17 U$5.54 32.76,31.17 C6.1 | 35.92,28.17 35.92,31.17 | 35.92,28.17 36.65,27.43 36.65,25.73 37.08,25.3 40.26,25.3 U$5.8 40.26,19.99 40.2,19.99 C38.1 40.06,18.07 38.24,16.24 R9.2 | 35.92,31.17 35.92,34.01 36.2,34.29 | 36.2,34.29 36.4,34.49 41.26,34.49 | 41.26,34.49 U$5.39 41.26,38.85 | 41.26,34.49 43.76,34.49 | 43.76,34.49 U$5.34 43.76,38.08 C11.1 | 43.76,34.49 45.03,34.49 45.09,34.54 | 45.09,34.54 45.09,36.83 46.68,38.42 52.7,38.42 | 45.09,34.54 45.09,30.67 U$5.26 51.77,30.67 C7.1 | JP3.4 34.8,35.69 36.2,34.29 | R13.2 20.32,3.17 | v58.83,38.42 52.7,38.42 | C1.1 52.41,34.62 52.7,34.92 52.7,38.42
  Top 0.406: C40.1 v62.69,40.61 | C41.1 71.12,33.71 | C56.1 71.14,33.68 71.12,33.71 | 71.12,33.71 63.42,33.71 62.69,32.97 v62.69,31.6 | R15.1 C25.1 8.76,30.7 7.41,30.7 U$7.4 | 17.98,11.44 18,11.43 17.98,11.43 C26.+ | C15.+ 62.87,53.3 | C22.1 6.57,25.68 | C1.1 U$1.4
  Top 0.584: U$2.8 U$2.7
  Top 0.61: U$2.3 22.84,3.17 | C31.1 20.3,14.67 U$2.8 | v23.7,25.5 R19.2 | R20.1 6.57,25.68 4.29,25.68 3,26.98 3,36.7 4.72,38.43 v8.69,38.43 R1.1 | R42.1 R43.2 13.32,63.01 11.88,61.57 v11.88,43.18
  Top 0.813: IC2.2 53.24,53.3 C14.1 | v18,8.95 18,11.43 C31.1 v18,16.41 v18,21.38 15.53,23.84 R20.1 | R30.2 89.59,27.1 81.53,19.05 62.69,19.05 JP1.2 | R18.1 62.48,25.19 62.69,25.4
  Top 1.016: IC2.2 IC2.TAB 59.45,53.32 C15.+ | v18,8.95 18,4.23 19.05,3.17 20.32,3.17 22.84,3.17 57.78,3.17 62.69,8.08 X2.2 62.69,19.05 62.69,25.4 v62.69,31.6 | 62.87,53.3 v66.04,53.3
  Bottom 0.406: R11.2 16.19,16.73 15.88,16.41 | v18,21.38 22.9,21.38 23.7,22.17 v23.7,25.5 | R16.2 18.84,9.8 v18,8.95
  Bottom 0.61: U1.4 15.88,16.41 v17.99,16.41 | v17.99,16.41 v18,16.41 | R8.2 v18,8.95 | v17.99,16.41 C29.1 | v11.88,43.18 9.53,43.18 8.69,42.34 v8.69,38.43 L3.1 | C2.1 v23.7,25.5 | v58.83,38.42 62.36,38.42 62.69,38.73
  Bottom 1.016: v66.04,53.3 66.04,48.26 62.69,44.91 v62.69,40.61 62.69,38.73 v62.69,31.6
_2V6  (via drill 0.6 pad 1.42)  (1 unrouted)
  Top 0.61: L2.2 v66.04,44.68
  Top 0.813: IC5.2 C54.1 | C51.+ 65.81,44.68
  Top 1.016: IC5.2 IC5.TAB C51.+
  Bottom 0.61: L1.2 74.04,42.29 71.65,44.68 v66.04,44.68
A3V  (via drill 0.6 pad 1.42)
  Top 0.305: IC4.22 17.58,37.28 16.43,38.43 v15.12,38.43
  Top 0.406: R4.2 24.34,42.74 25.29,42.74 25.29,43.98 R5.2 | C16.1 26.85,44.32 C59.1 | C59.1 | C59.1 26.85,51.33 26.11,52.07 24.31,52.07 | C55.1 18.53,54.98 17.86,54.3 17.86,50.16 19.26,48.77 19.26,46.79 | C17.1 19.08,46.97 19.26,46.79 | 19.26,46.79 R3.2 19.27,45.04 18.29,45.04 18.29,43.81 R2.2 15.12,43.81 R10.2 R7.2 C21.1 | v15.12,38.43 C21.1 | C21.1
  Top 0.61: R5.2 C16.1 | RJ1.P4 24.31,52.07 RJ1.P5 C55.1
  Bottom 0.61: v15.12,38.43 L3.2
AN_3V
  Top 0.305: C9.1 49.59,25.19 47.61,27.17 U$5.19
  Top 0.61: C9.1 C10.1 R18.2
D2_N
  Top 0.406: IC1.1 43.47,63.78 X3.2
D2_P
  Top 0.406: IC1.3 41.57,63.78 X3.3
D_N
  Top 0.254: IC1.6 43.47,58.84 42.76,58.13 U$5.36
D_P
  Top 0.254: IC1.4 41.57,58.84 42.26,58.14 U$5.37
DP_RST  (via drill 0.6 pad 1.42)
  Top 0.305: IC4.29 13.65,32.55 12.72,33.48 10.97,33.48 R1.2 | U$5.57 32.05,29.67 29.08,32.64 v29.08,34.49
  Top 0.406: v5.99,35.76 8.68,35.76 R1.2
  Bottom 0.305: v5.99,35.76 9.55,35.76 10.82,34.49 v29.08,34.49
ECRSDV
  Top 0.305: IC4.40 18.08,24.77 20.6,22.25 27.64,22.25 30.18,24.79 35.36,24.79 36.02,25.45 36.02,26.95 35.8,27.17 U$5.62
EINT
  Top 0.305: IC4.7 22.69,32.05 22.68,32.05 22.4,32.05 22.12,31.77 22.12,29.01 22.73,28.4 23.7,28.4 R19.1
EMDC  (via drill 0.6 pad 1.42)
  Top 0.305: IC4.31 6.73,31.55 5.99,32.28 v5.99,33.96 | U$5.30 48.24,32.67 v48.84,33.27
  Bottom 0.305: v5.99,33.96 7.11,35.08 9.37,35.08 10.57,33.88 28.04,33.88 28.6,33.33 30.23,33.33 32.36,35.46 33.91,35.46 36.68,32.69 48.26,32.69 v48.84,33.27 49.43,33.27
EMDIO  (via drill 0.6 pad 1.42)
  Top 0.305: IC4.30 13.24,32.05 12.89,32.4 R15.2 11.19,32.4 9.63,33.96 v8.53,33.96 | U$5.49 34.03,33.67 v33.42,34.29
  Bottom 0.305: v8.53,33.96 9.63,33.96 10.31,33.27 27.79,33.27 28.35,32.72 30.48,32.72 32.05,34.29 v33.42,34.29
EREFCLK  (via drill 0.6 pad 1.42)
  Top 0.305: U$7.3 7.4,28.71 8.18,29.49 v10.52,29.49 13.44,29.49 14,30.05 IC4.34 | U$5.63 31.98,26.67 v31.88,26.57
  Bottom 0.305: v10.52,29.49 18.06,29.49 19.79,31.22 27.81,31.22 28.5,30.53 28.5,29.74 29.03,29.21 30,29.21 31.88,27.33 v31.88,26.57
ERXD0
  Top 0.305: IC4.43 19.58,25 20.98,23.6 27.25,23.6 31.33,27.67 U$5.61
ERXD1
  Top 0.305: IC4.44 20.08,25.36 21.23,24.21 24.41,24.21 29.37,29.17 U$5.58
ERXERR
  Top 0.305: IC4.41 18.58,25.13 20.85,22.86 27.38,22.86 29.92,25.4 33.4,25.4 34.17,26.17 U$5.64
ETXD0  (via drill 0.6 pad 1.42)
  Top 0.305: IC4.3 25.42,30.05 v27.33,30.05 | U$5.2 37.26,23.37 36.91,23.01 v32.87,23.01
  Bottom 0.305: v27.33,30.05 28.78,28.6 29.74,28.6 30.71,27.64 30.71,26.09 32.87,23.93 v32.87,23.01
ETXD1  (via drill 0.6 pad 1.42)
  Top 0.305: IC4.4 26.18,30.55 26.85,31.22 28.85,31.22 v29.69,30.38 | U$5.3 37.76,23.01 37.16,22.4 34.7,22.4 v34.04,21.74
  Bottom 0.305: v29.69,30.38 33.05,27.03 33.05,24.61 34.04,23.62 v34.04,21.74
ETXEN  (via drill 0.6 pad 1.42)
  Top 0.305: IC4.2 25.39,29.55 v26.11,28.83 | U$5.1 36.76,24.18 32.32,24.18 v31.14,23
  Bottom 0.305: v26.11,28.83 27.69,28.83 28.52,27.99 29.49,27.99 30.1,27.38 30.1,25.83 31.14,24.79 v31.14,23
FLASH_CS  (via drill 0.6 pad 1.42)
  Top 0.305: U$5.11 41.76,18.18 46.84,13.11 46.84,8.59 44.35,6.1 v25.91,6.1
  Top 0.61: R13.1 v20.32,6.99 20.32,7.11 v20.3,7.14 U$2.1
  Bottom 0.406: v20.32,6.99 25.02,6.99 v25.91,6.1
GND  (via drill 0.5 pad 1.27, 0.5 pad 1.42, 0.6 pad 1.42, 0.61 pad 1.42)
  Top 0.251: U2.4 70.43,41.38 69.38,42.41 C45.2 | U2.20 76.95,36.83 77.42,36.83 | 77.42,36.83 77.95,36.83 U2.22 77.95,33.73 C42.2 | U2.21 77.45,36.8 77.42,36.83 | U2.16 74.95,34.95 74.67,34.66 C41.2
  Top 0.254: IC1.2 42.35,62.17 42.35,61.34 42.07,61.06 39.98,61.06
  Top 0.305: v21.82,39.85 21.82,38.66 21.08,37.92 IC4.15 21.08,33.14 | IC4.19 19.08,38.38 18.08,39.38 C18.2 | IC4.35 14.36,29.55 13.54,28.73 | IC4.47 v21.58,25.63 | IC4.6 24.59,31.55 25.26,32.22 v25.26,35.79 | U$5.59 29.74,28.67 28.7,27.64 28.7,27.2 | U$5.55 31.99,30.67 30.96,31.7 | U$5.7 39.76,21.4 38.76,20.4 C38.2 | U$5.25 52.55,30.17 53.67,31.29 53.67,31.7 C7.2 | U$5.35 43.26,38.89 44.35,39.98 44.64,39.98 C11.2 | U$5.20 48.2,27.67 49.12,26.75 | U$5.40 40.76,38.03 40.39,38.41 40.39,40.25 C4.2
  Top 0.406: JP5.GND1 v59.02,63.01
  other vias: 26.09,8.36 50.75,56.54 64.52,39.09 66.03,42.02 71.58,36.12 79.6,29.84 71.6,29.84 85.19,43.64 62.92,56.26 87.1,35.53 18.62,41.81 11.88,41.05 12.09,35.99 12.06,27.65 25.55,46.56 7.24,32.74 4.42,28.92 15.36,46.56 28.72,46.56 13.07,5.74 25.31,27.08 20.94,19.91 88.27,19.68 4.82,50.19 38.35,18.26 46.3,35.86 25.98,14.99 27.68,25.76 55.29,33.78 60.17,32.36 45.16,46.56 45.16,53.75 50.75,47.83 59.64,49.1 54.2,26.97 52.65,40.21 59.18,22.3 49.53,18.41 41.04,41.91 75.56,12.06
  pour Top (isolate 0.305, rank 2, no thermals): 0,0 0,68.58 93.34,68.58 93.34,0
  pour Bottom (isolate 0.305, no thermals): 0,68.58 0,0 93.34,0 93.34,68.58
LED_ACT
  Top 0.305: RJ1.G- 18.36,65.89 12.22,65.89 10.52,64.19 10.52,35.84 11.67,34.69 13.22,34.69 13.85,34.05 IC4.26
LED_LINK
  Top 0.305: IC4.28 14,33.05 12.96,34.09 11.4,34.09 9.91,35.59 9.91,64.44 11.96,66.5 20.14,66.5 22,64.64 RJ1.Y-
MCLR
  Top 0.203: R12.1 39.89,16.07 | R12.1 39.66,16.01 | 39.41,16.35 R12.1 | 39.61,16.15 R12.1
  Top 0.305: 39.66,16.01 39.04,15.39 36.85,15.39 35.41,13.95 JP2.1 | U$5.9 40.76,17.9 39.66,16.8 R12.1
MISO  (via drill 0.6 pad 1.42)
  Top 0.305: v27.3,11.89 21.85,11.89 21.57,11.61 U$2.2 | U$5.5 38.76,22.18 35.69,19.1 29.41,19.1 28.57,18.26 28.57,13.16 v27.3,11.89 | v27.3,11.89 27.13,11.89
  Bottom 0.305: R16.1 20.32,11.5 20.32,11.89
  Bottom 0.406: U1.7 16.18,13.11 17.39,11.89 20.32,11.89 v27.3,11.89
MOSI  (via drill 0.6 pad 1.42)
  Top 0.406: v25.98,16.84 R14.2
  Top 0.584: v25.98,16.84 U$2.5
  Bottom 0.305: U1.3 14.37,17.58 25.25,17.58 v25.98,16.84
N$1
  Top 0.305: IC4.21 18.08,37.65 16.42,39.3 R7.1
N$2
  Top 0.406: R12.2 40.96,14.83 C28.1 40.67,14.54 R9.1
N$3
  Top 0.305: IC4.24 R6.1
N$4
  Top 0.305: U$5.6 39.26,21.81 35.94,18.49 29.9,18.49 29.43,18.02 R14.1
N$6
  Top 0.305: IC4.20 18.58,38.01 17.14,39.45 17.14,42.05 R10.1
N$7
  cutout Top: 16.51,27.99 16.51,29.72 15.93,29.72 15.93,27.99
N$8  (via drill 0.6 pad 1.27)
  other vias: 88.34,5
N$9  (via drill 0.6 pad 1.27)
  other vias: 88.34,63.58
N$11  (via drill 0.6 pad 1.27)
  other vias: 5,63.58
N$12
  Top 0.61: R42.2 RJ1.G+
N$17
  Top 0.406: JP5.VBUS1 F1.1
  Top 0.61: F1.1 64.49,63.33 X1.1
N$18
  Top 0.406: C36.2 R23.1
N$19
  Top 0.406: R43.1 28.7,63.07 RJ1.Y+
N$36  (via drill 0.6 pad 1.27)
  other vias: 5,5
PGEC  (via drill 0.6 pad 1.42)
  Top 0.305: U$5.15 43.76,23.42 45.57,21.61 v45.57,19.71
  Bottom 0.305: v45.57,19.71 JP2.5
PGED  (via drill 0.6 pad 1.42)
  Top 0.305: U$5.16 44.26,23.63 46.84,21.06 v46.84,18.54
  Bottom 0.305: v46.84,18.54 46.84,9.88 46.18,9.22 44.12,9.22 43.03,10.31 JP2.4
PH0
  Top 0.305: U$5.31 47.37,33.17 47.67,33.47 U$1.3
RB3
  Top 0.305: U$5.13 42.76,18.93 45.19,16.51 JP1.5
RB4
  Top 0.305: U$5.12 42.26,18.55 44.91,15.9 51.36,15.9 52.12,15.14 54.51,15.14 JP1.3
RB6
  Top 0.305: JP1.6 51.44,19.05 47.17,23.32 47.17,25.88 46.88,26.17 U$5.17
RB7
  Top 0.305: U$5.18 47.24,26.67 47.78,26.14 47.78,23.57 50.98,20.37 54.56,20.37 JP1.4
RC13
  Top 0.305: U$5.47 37.26,46.18 34.57,48.87 JP6.5
RC14
  Top 0.305: U$5.48 36.76,45.79 33.25,49.3 33.25,51.23 JP6.6
RD_N
  Top 0.254: 23.5,43.89 23.5,38.84 22.08,37.43 IC4.13 | 23.5,43.89 23.5,45.11 arc-90 23.88,45.49 23.99,45.49 arc90 24.37,45.87 24.37,45.88 arc90 23.99,46.27 23.88,46.27 arc-90 23.5,46.65 23.5,46.66 arc-90 23.88,47.04 23.99,47.04 arc90 24.37,47.42 24.37,47.43 arc90 23.99,47.81 23.88,47.81 arc-90 23.5,48.19 23.5,48.72 RJ1.RD- | R5.1 23.58,43.98 23.5,43.89
RD_P
  Top 0.254: 23.04,42.44 23.04,48.97 21.77,50.24 RJ1.RD+ | IC4.14 21.58,37.57 23.04,39.03 23.04,42.44 | R4.1 22.99,42.39 23.04,42.44
REG_OUT
  Top 0.305: 17.08,34.65 IC4.23 17.08,36.92 16.74,37.26 C19.1 | 17.08,34.65 19.58,34.65 IC4.18 19.58,40.13 C18.1 | 17.08,34.65 16.58,34.15 IC4.37 C24.1
  Top 0.406: C19.1 12.57,37.25 C32.1
RX_DV
  Top 0.305: IC4.39 17.58,26.03 R20.2
SCK  (via drill 0.6 pad 1.42)
  Top 0.305: v25.98,13.13 23.95,13.13 22.84,14.25 U$2.6 22.84,18.26 24.28,19.71 35.43,19.71 38.26,22.54 U$5.4
  Bottom 0.305: U1.5 14.37,15.24 15.85,15.24 17.96,13.13 v25.98,13.13
SCL1
  Top 0.305: U$5.44 38.76,36.55 37.8,37.52 37.8,47.3 35.84,49.25 35.84,51.28 JP6.4
SCL5
  Top 0.305: U$5.42 39.76,37.27 39.01,38.02 39.01,48.62 38.38,49.25 38.38,51.28 JP6.2
SD_CS  (via drill 0.6 pad 1.42)
  Top 0.305: U$5.14 43.26,23.06 44.4,21.92 v44.4,21.01
  Bottom 0.305: U1.2 15.88,18.61 | 16.26,18.48 R11.1 | v25.98,18.58 36.03,18.58 38.46,21.01 v44.4,21.01
  Bottom 0.406: 15.88,18.61 16.06,18.43 R11.1 16.36,18.58 v25.98,18.58
SD_PRESENT  (via drill 0.6 pad 1.42)
  Top 0.305: U$5.10 41.26,17.82 44.27,14.81 44.27,8.71 43.56,8 28.69,8 v26.04,10.65
  Bottom 0.305: 16.09,10.65 R8.1 v26.04,10.65
  Bottom 0.61: U1.CD1 R8.1
SDA1
  Top 0.305: U$5.43 39.26,36.91 38.41,37.77 38.41,47.62 37.11,48.92 JP6.3 37.11,49.78
SDA5
  Top 0.305: U$5.41 40.26,37.64 39.62,38.28 39.62,49.99 JP6.1
TD_N
  Top 0.254: IC4.16 20.58,45.52 | 20.58,45.52 20.58,46.3 arc-90 21.01,46.74 21.24,46.74 arc90 21.68,47.17 21.68,47.18 arc90 21.24,47.61 21.01,47.61 arc-90 20.58,48.05 20.58,48.05 arc-90 21.01,48.49 21.24,48.49 arc90 21.68,48.92 21.68,48.93 arc90 21.24,49.36 21.01,49.36 arc-90 20.58,49.8 20.58,50.72 RJ1.TD- | R3.1 20.71,45.39 20.58,45.52
TD_P
  Top 0.254: IC4.17 20.08,43.61 | 20.08,43.61 20.08,49.37 19.23,50.22 RJ1.TD+ | R2.1 19.88,43.81 20.08,43.61
U1_RX
  Top 0.305: U$5.50 32.89,33.17 32.26,33.81 JP3.3
U1_TX
  Top 0.305: U$5.51 32.53,32.67 31.65,33.55 31.65,36.3 29.72,38.23 JP3.2
VBUS
  Top 0.254: IC1.5 42.69,59.87 42.69,60.78 42.98,61.06 45.01,61.06
  Top 0.305: C52.+ 47.65,40.51 44.26,37.13 U$5.33
  Top 0.406: C30.+ 47.65,56.11 47.65,55.88
  Top 0.61: C27.1 X3.1
  Top 0.813: X3.1 45.01,62.82 45.01,61.06 45.01,59.13 45.72,58.42 47.65,58.42 | IC2.3 53.23,51 C13.1 | IC5.3 | IC5.3 | 47.65,58.42 47.65,55.88 C12.+ C13.1 | IC5.3 50.76,42.37 C53.1 50.74,42.37 48.29,42.37 C52.+ | C13.1 | 47.65,58.42 60.96,58.42 61.62,59.09 F1.2
  Top 1.016: C12.+ C52.+
VS_AGND
  Top 0.251: U2.47 73.95,45.02 72.35,46.62 C35.2 | U2.41 76.95,45.33 77.33,45.33 77.45,45.21 | U2.40 77.45,45.21 | 77.45,45.21 77.45,47.2 C34.2 | U2.37 78.95,45.04 80.14,46.23 82.93,46.23 83.25,46.55 C33.2
  Top 0.406: C35.2 R25.1 69.1,48.92 C39.1 | C37.1 C33.2 | 69.2,53.37 69.1,53.47 | C34.2 78.68,48.42 R33.2
  Top 0.61: C39.1 69.1,53.47 69.1,55.12 | 76.81,56.03 C36.1 R33.2 | 69.1,55.12 69.1,55.89 | R34.2 69.1,55.12 | C37.1 83.25,54.8
  pour Top (isolate 0.305, no thermals): 68.58,68.71 68.58,46.99 85.85,46.99 85.85,53.59 82.55,56.9 82.55,68.71
VS_AVDD  (via drill 0.6 pad 1.42)
  Top 0.251: C35.1 74.05,46.62 74.95,45.73 U2.45 74.95,43.43 75.95,43.43 | C34.1 75.95,46.76 U2.43 75.95,43.43 | C33.1 80.2,47.41 78.45,45.66 U2.38 78.45,43.43 | 78.45,43.43 75.95,43.43 | 78.45,43.43 79.53,43.43 v80.39,44.3
  Top 0.406: v80.39,44.3 81.69,45.59 84.95,45.59 C58.1
  Bottom 0.61: L1.1 78.38,42.29 v80.39,44.3
VS_CVDD
  Top 0.251: C45.1 69.11,40.88 U2.5 72.97,40.88 | 72.97,40.88 72.97,43.36 | 78.95,39.88 U2.24 78.95,34.72 C48.1 | 78.95,39.88 79.45,40.38 U2.31 C47.1 | 72.97,40.88 72.97,39.88 | 72.97,39.88 78.95,39.88 | 72.97,39.88 U2.7 66.64,39.88 C46.1
  Top 0.254: 72.97,43.36 71.65,44.68 L2.1
  Top 0.61: C47.1 C57.1
VS_DREQ
  Top 0.254: U2.8 68.08,39.38 67.56,38.86 67.56,37.19 65.76,35.38 55.19,35.38 50.98,31.17 U$5.27
VS_MISO  (via drill 0.6 pad 1.42)
  Top 0.251: 84.86,37.52 84.86,38.05 83.03,39.88 82.5,39.88
  Top 0.254: 81.83,39.88 U2.30 82.5,39.88 | 84.86,37.52 84.86,26.62 81,22.76 69.83,22.76 69.24,22.17 v67.44,22.17
  Top 0.305: U$5.22 55.29,28.67 v56.08,29.46
  Bottom 0.305: v56.08,29.46 58.4,29.46 65.68,22.17 v67.44,22.17
VS_MOSI  (via drill 0.6 pad 1.42)
  Top 0.251: 84.3,37.29 84.3,37.82 82.74,39.38 82.21,39.38
  Top 0.254: U2.29 82.21,39.38 | 84.3,37.29 84.3,26.85 80.77,23.32 v68.76,23.32
  Top 0.305: U$5.23 54.06,29.17 v56.08,31.19
  Bottom 0.305: v68.76,23.32 65.38,23.32 57.51,31.19 v56.08,31.19
VS_N$9
  Top 0.251: U2.18 75.95,32.07 | 75.95,32.07 75.95,29.23 76.55,28.63 R35.2 | Y3.1 76.02,32.14 75.95,32.07
  Top 0.61: R35.2 C50.1
VS_N$13
  Top 0.251: U2.17 75.45,29.84 | 75.45,29.84 75.45,29.2 74.85,28.6 R35.1 | Y3.3 75.45,29.84
  Top 0.254: R35.1 74.85,27.59
  Top 0.61: R35.1 C49.1
VS_N$14
  Top 0.251: U2.46 74.45,45.36 73.2,46.61 73.2,49.55 74.05,50.41 R22.2
  Top 0.406: R22.2 R31.2
VS_N$15
  Top 0.251: U2.42 76.45,46.2 76.81,46.56 R23.2
VS_N$16
  Top 0.251: U2.39 77.95,45.97 79.87,47.89 R24.2
  Top 0.406: R24.2 79.87,50.08 80.37,50.57 80.37,52.02 R32.2
VS_N$17
  Top 0.251: U2.44 75.45,45.94 75.01,46.38 75.01,48.55 74.05,48.55 R25.2
VS_N$24
  Top 0.305: 81.55,49.48 R24.1
  Top 0.406: C37.2 81.55,49.48
VS_N$25
  Top 0.406: C39.2 R22.1
VS_N$26
  Top 0.251: U2.10 71.05,38.38 70.45,38.38 R29.1
VS_N$27
  Top 0.251: U2.9 69.23,38.88 R28.1
VS_N$28
  Top 0.251: U2.34 82.17,41.88 R27.1
VS_N$30
  Top 0.251: U2.33 83.44,41.38 R26.1
VS_N$34
  Top 0.251: U2.26 R30.1
VS_N$35
  Top 0.406: R31.1 C43.1
VS_N$36
  Top 0.406: R32.1 C44.1
VS_N$37
  Top 0.61: C44.2 80.35,55.07 R33.1 80.38,60.8 78.79,62.38 J1.RING1
VS_N$38
  Top 0.406: C43.2 74.05,55.1 R34.1
  Top 0.61: 74.05,55.1 74.05,57.39 75.04,58.38 J1.TIP
VS_SCK  (via drill 0.6 pad 1.42)
  Top 0.251: 83.74,37.06 83.74,37.59 82.45,38.88 81.92,38.88
  Top 0.254: U2.28 81.92,38.88 | 83.74,37.06 83.74,27.08 80.54,23.88 69.83,23.88 69.24,24.46 v67.44,24.46
  Top 0.305: U$5.29 49.49,32.17 v50.57,33.25
  Bottom 0.305: v50.57,33.25 53.75,33.25 54.61,32.38 57.15,32.38 65.08,24.46 v67.44,24.46
VS_XCS
  Top 0.254: U2.23 78.45,37.22 78.18,37.49 73.53,37.49 72.87,36.83 72.87,35.51 72.16,34.8 58.04,34.8 52.91,29.67 U$5.24
VS_XDCS
  Top 0.254: U2.13 73.45,35.3 72.44,34.29 58.37,34.29 57.25,33.17 57.25,28.98 56.44,28.17 U$5.21
VS_XRST
  Top 0.254: U2.3 71.15,41.88 69.85,43.18 62.87,43.18 61.52,41.83 61.52,37.84
  Top 0.305: U$5.28 50.67,31.67 54.97,35.97 60.58,35.97 61.52,36.91 61.52,37.84 R36.1